# Altium schematic sheet POWER.SchDoc
size A4; SheetNumber: 3; SheetTotal: 3
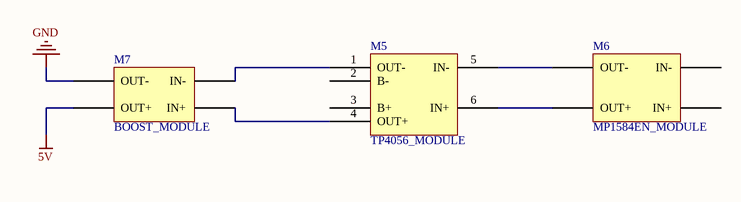
[diagram p0: POWER.SchDoc]

## Parts
M5  TP4056_MODULE  [TP4056_MODULE]
M6  MP1584EN_MODULE  [MP1584EN_MODULE]
M7  BOOST_MODULE  [BOOST_MODULE_MINI]

## Nets
5V: M7.3(OUT+)
GND: M7.4(OUT-)
NetM5_1: M5.1(OUT-) M7.2(IN-)
NetM5_4: M5.4(OUT+) M7.1(IN+)
NetM5_5: M5.5(IN-) M6.4(OUT-)
NetM5_6: M5.6(IN+) M6.3(OUT+)

Not connected (* = marked no-connect by the designer): M5 2(B-) 3(B+); M6 1(IN+) 2(IN-)